# Altium schematic sheet Sheet6.SchDoc
size A4; SheetNumber: 1; SheetTotal: 1
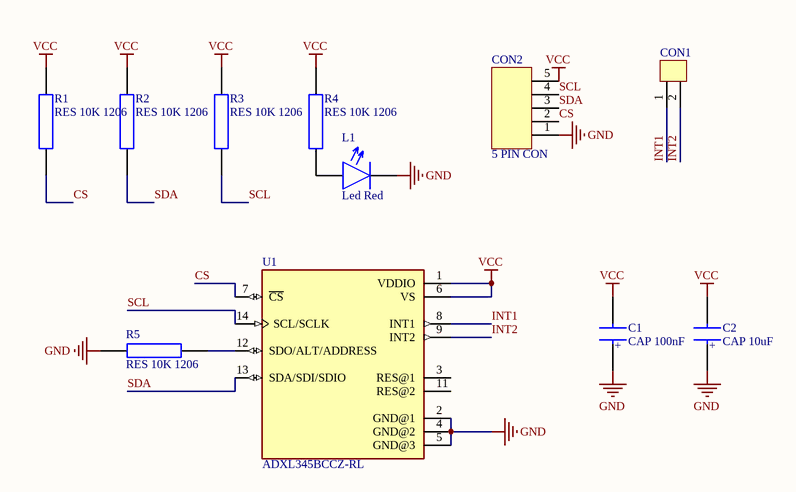
[diagram p0: Sheet6.SchDoc]

## Parts
C1  CAP 100nF  [CAP_805]
C2  CAP 10uF  [CAP_805]
CON1  2 Pin Jst Konnektör  [2 pin konnektor]  (value not drawn)
CON2  5 PIN CON  [5 PIN 2.54MM]
L1  Led Red  [Led 1206]
R1  RES 10K 1206  [RES_1206]
R2  RES 10K 1206  [RES_1206]
R3  RES 10K 1206  [RES_1206]
R4  RES 10K 1206  [RES_1206]
R5  RES 10K 1206  [RES_1206]
U1  ADXL345BCCZ-RL  [PQFN80P300X500X79-14N]

## Nets
GND: C1.1 C2.1 CON2.1 L1.2 R5.1 U1.2(GND@1) U1.4(GND@2) U1.5(GND@3)
VCC: C1.2 C2.2 CON2.5 R1.1 R2.1 R3.1 R4.1 U1.1(VDDIO) U1.6(VS)
CS: CON2.2 R1.2 U1.7(~{CS})
INT1: CON1.1 U1.8(INT1)
INT2: CON1.2 U1.9(INT2)
SCL: CON2.4 R3.2 U1.14(SCL/SCLK)
SDA: CON2.3 R2.2 U1.13(SDA/SDI/SDIO)
NetL1_1: L1.1 R4.2
NetR5_2: R5.2 U1.12(SDO/ALT/ADDRESS)

Not connected (* = marked no-connect by the designer): U1 3(RES@1) 11(RES@2)

## Notes on the sheet
- (in symbol CAP 1uF) +

## Library data of the parts
C1 C2 = CAP 1uF: 0805 smd
CON1 = 2 Pin Jst Konnektör: 2.50 mm 2 pin jst
CON2 = 5 PIN CON: 2.54mm vertical connector
U1 = ADXL345BCCZ-RL: Accelerometer X, Y, Z Axis Â±2g, 4g, 8g, 16g 0.05Hz ~ 1.6kHz 14-LGA (3x5); MF: Analog Devices; Check_prices: https://www.snapeda.com/parts/ADXL345BCCZ-RL/Analog%20Devices%20Inc./view-part/52306/?ref=eda; Value: *; Package: LGA -14 Analog Devices; Price: None; MP: ADXL345BCCZ-RL; Purchase-URL: https://pricing.snapeda.com/search/part/ADXL345BCCZ-RL/?ref=eda; SnapEDA_Link: https://www.snapeda.com/parts/ADXL345BCCZ-RL/Analog%20Devices%20Inc./view-part/52306/?ref=snap; Availability: Warning